# EAGLE design usbasp_mini (EAGLE 7.1.0)
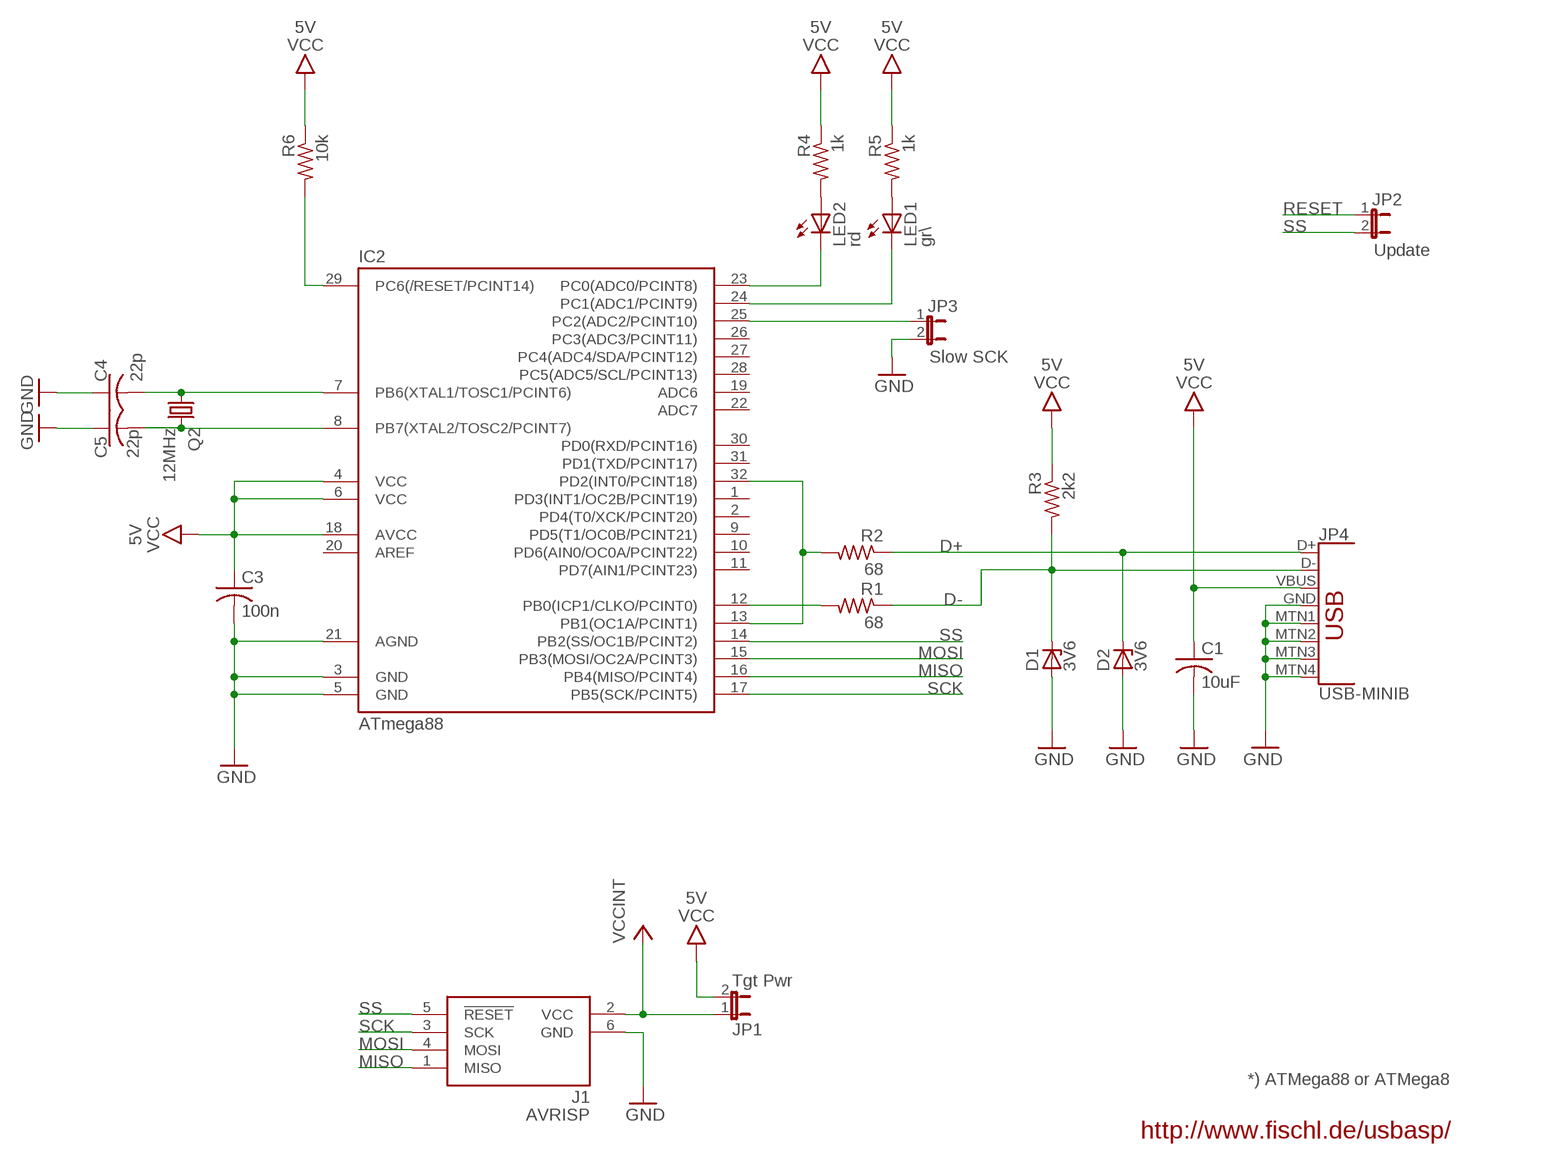
[diagram p0: schematic, sheet 1]

## Parts
C1  10uF  C-1206  [1206]
C3  100n  C-0603  [0603]
C4  22p  C-0603  [0603]
C5  22p  C-0603  [0603]
D1  3V6  ZENER-DIODESMB  [SMB]
D2  3V6  ZENER-DIODESMB  [SMB]
IC2  ATmega88  MEGA48/88/168-AU  [TQFP32-08]
J1  AVRISP  AVRISP6_COMPACT  [CON6P2R]
JP1  Tgt Pwr  JP1E  [JP1]
JP2  Update  JP1E  [JP1]
JP3  Slow SCK  JP1E  [JP1]
JP4  USB-MINIB  [USB-MINIB]
LED1  gr\  LEDCHIPLED_0603  [CHIPLED_0603]
LED2  rd  LEDCHIPLED_0603  [CHIPLED_0603]
Q2  12MHz  CRYSTALNDK5X3  [NDK_2PAD_5X3]
R1  68  R0603  [0603]
R2  68  R0603  [0603]
R3  2k2  R0603  [0603]
R4  1k  R0603  [0603]
R5  1k  R0603  [0603]
R6  10k  R0603  [0603]

## Nets
D+: D2.C JP4.D+ R2.1
D-: D1.C JP4.D- R1.1 R3.2
GND: C1.2(-) C3.2(-) C4.1(+) C5.1(+) D1.A D2.A IC2.3(GND) IC2.5(GND) IC2.21(AGND) J1.6(GND) JP3.2 JP4.GND JP4.MTN1(SHIELD1) JP4.MTN2(SHIELD2) JP4.MTN3(SHIELD3) JP4.MTN4(SHIELD4)
MISO: IC2.16(PB4(MISO/PCINT4)) J1.1(MISO)
MOSI: IC2.15(PB3(MOSI/OC2A/PCINT3)) J1.4(MOSI)
N$7: IC2.13(PB1(OC1A/PCINT1)) IC2.32(PD2(INT0/PCINT18)) R2.2
N$13: LED2.A R4.2
N$16: IC2.12(PB0(ICP1/CLKO/PCINT0)) R1.2
N$22: C4.2(-) IC2.7(PB6(XTAL1/TOSC1/PCINT6)) Q2.P$1
N$23: C5.2(-) IC2.8(PB7(XTAL2/TOSC2/PCINT7)) Q2.P$2
N$25: LED1.A R5.2
PC0: IC2.23(PC0(ADC0/PCINT8)) LED2.C
PC1: IC2.24(PC1(ADC1/PCINT9)) LED1.C
PC2: IC2.25(PC2(ADC2/PCINT10)) JP3.1
RESET: IC2.29(PC6(/RESET/PCINT14)) JP2.1 R6.2
SCK: IC2.17(PB5(SCK/PCINT5)) J1.3(SCK)
SS: IC2.14(PB2(SS/OC1B/PCINT2)) J1.5(!RESET) JP2.2
VCC: C1.1(+) C3.1(+) IC2.4(VCC) IC2.6(VCC) IC2.18(AVCC) JP1.2 JP4.VBUS R3.1 R4.1 R5.1 R6.1 ; supply symbol labelled 5V
VCCINT: J1.2(VCC) JP1.1
Unconnected: IC2.1(PD3(INT1/OC2B/PCINT19)) IC2.2(PD4(T0/XCK/PCINT20)) IC2.9(PD5(T1/OC0B/PCINT21)) IC2.10(PD6(AIN0/OC0A/PCINT22)) IC2.11(PD7(AIN1/PCINT23)) IC2.19(ADC6) IC2.20(AREF) IC2.22(ADC7) IC2.26(PC3(ADC3/PCINT11)) IC2.27(PC4(ADC4/SDA/PCINT12)) IC2.28(PC5(ADC5/SCL/PCINT13)) IC2.30(PD0(RXD/PCINT16)) IC2.31(PD1(TXD/PCINT17))

## Notes on the sheet
- *) ATMega88 or ATMega8
- http://www.fischl.de/usbasp/

## Library data of the parts
C1 C3-C5 = bt_rcl:C: Capacitor, non-polarized, American symbol
D1 D2 = diode:ZENER-DIODE: Z-Diode
IC2 = avr-7:MEGA48/88/168
J1 = bt_avr:AVRISP6: 6-pin dual-row connector for Atmel AVRISP programmer interface
JP1-JP3 = jumper:JP1E: JUMPER
JP4 = bt_electromech:USB: USB Connectors USB-MINI-B is fully proven USB-A-PCB is untested. USB-MICRO-B is untested.; PROD_ID: CONN-08193
LED1 LED2 = led:LED: LED OSRAM: - CHIPLED LG R971, LG N971, LY N971, LG Q971, LY Q971, LO R971, LY R971 LH N974, LH R974 LS Q976, LO Q976, LY Q976 LO Q996 - Hyper CHIPLED LW Q18S LB Q993, LB Q99A, LB R99A - SideLED LS A670, LO A670, LY A670, LG A670, LP A670 LB A673, LV A673, LT A673, LW A673 LH A674 LY A675 LS A676, LA A676, LO A676, LY A676, LW A676 LS A679, LY A679, LG A679 - Hyper Micro SIDELED® LS Y876, LA Y876, LO Y876, LY Y876 LT Y87S - SmartLED LW L88C, LW L88S LB L89C, LB L89S, LG L890 LS L89K, LO L89K, LY L89K LS L896, LA L896, LO L896, LY L896 - TOPLED LS T670, LO T670, LY T670, LG T670, LP T670 LSG T670, LSP T670, LSY T670, LOP T670, LYG T670 LG T671, LOG T671, LSG T671 LB T673, LV T673, LT T673, LW T673 LH T674 LS T676, LA T676, LO T676, LY T676, LB T676, LH T676, LSB T676, LW T676 LB T67C, LV T67C, LT T67C, LS T67K, LO T67K, LY T67K, LW E67C LS E67B, LA E67B, LO E67B, LY E67B, LB E67C, LV E67C, LT E67C LW T67C LS T679, LY T679, LG T679 LS T770, LO T770, LY T770, LG T770, LP T770 LB T773, LV T773, LT T773, LW T773 LH T774 LS E675, LA E675, LY E675, LS T675 LS T776, LA T776, LO T776, LY T776, LB T776 LHGB T686 LT T68C, LB T68C - Hyper Mini TOPLED® LB M676 - Mini TOPLED Santana® LG M470 LS M47K, LO M47K, LY M47K Source: http://www.osram.convergy.de/
Q2 = bt_crystal:CRYSTAL: CRYSTAL
R1-R6 = bt_rcl:R: Resistor, American symbol

## Board
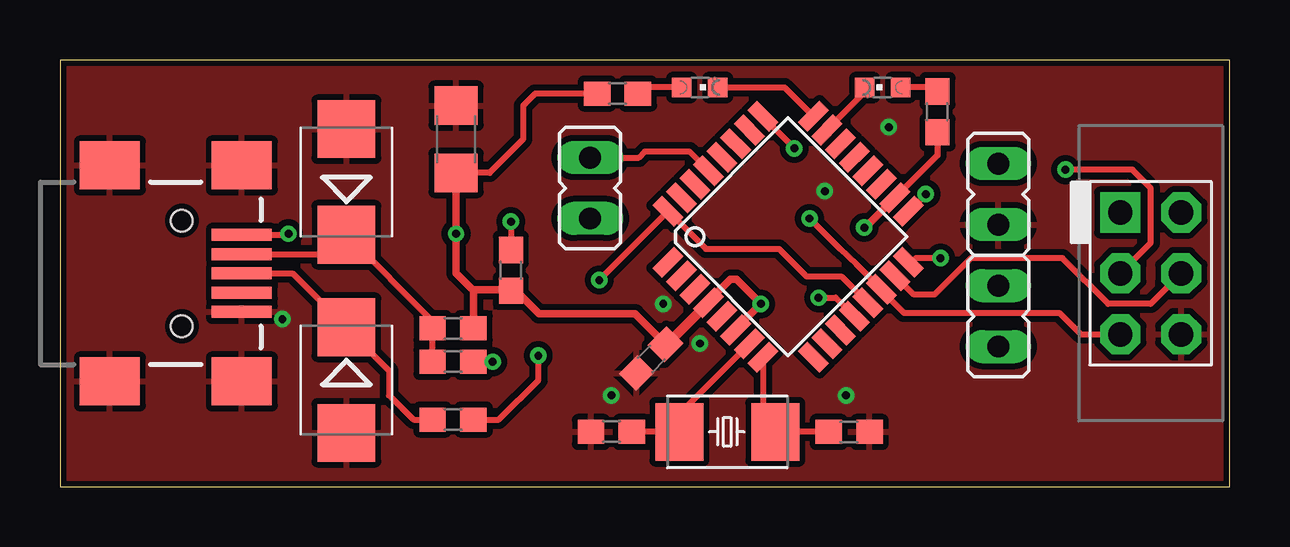
[diagram p1: board, top side]
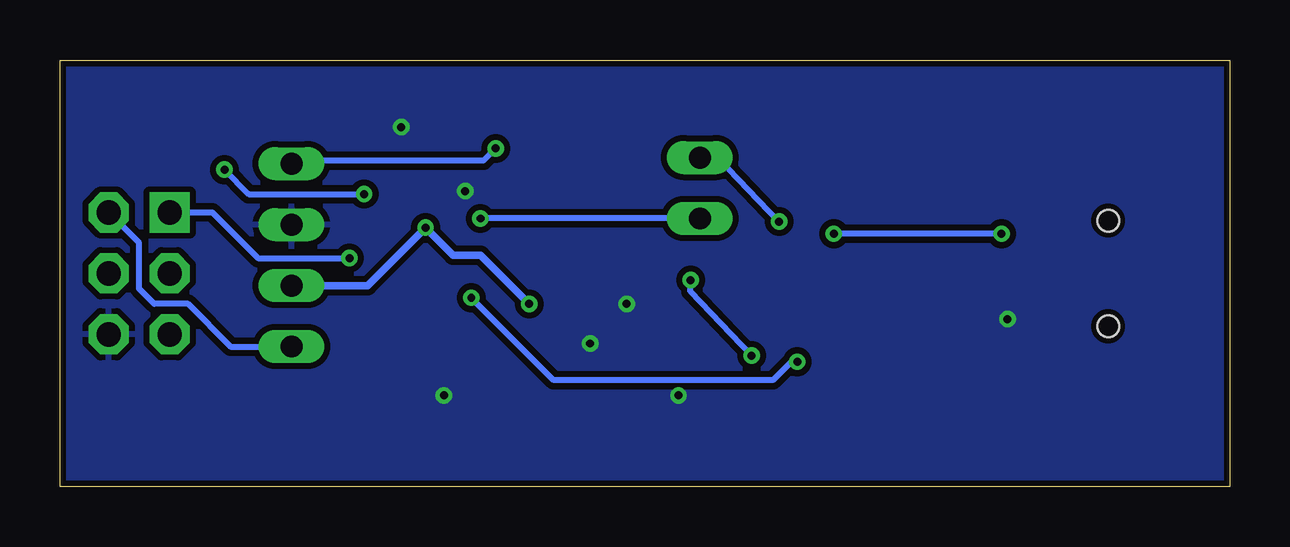
[diagram p2: board, bottom side, seen from below]

Size 48.77 x 17.78 mm. Coordinates in mm from the lower left corner, seen from the top.
Outline: 0,0 48.77,0 48.77,17.78 0,17.78 0,0
Copper layers (1*16): Top 0.0356mm / dielectric 1.5011mm / Bottom 0.0356mm
Design rules "LaenPCBOrder *": minimum track width 6mil, minimum drill 13mil, track to track 10mil, track to pad 8mil, pad to pad 8mil, via to via 10mil, smd to smd 8mil, copper to edge 10mil, drill to drill 10mil, minimum pad ring 7mil, minimum via ring 7mil, stop-mask expansion 3mil, vias tented up to drill 20mil, thermal gap 10mil

### Footprints (pad centres in the part's own frame; a part is rotated, then mirrored left to right if it is on the bottom)
1206 = smd 1.6 x 1.8: 1 -1.4,0; 2 1.4,0
0603 = smd 1.1 x 1: 1 -0.85,0; 2 0.85,0
SMB = smd 2.4 x 2.4: A 2.2,0; C -2.2,0
TQFP32-08 = smd 1.27 x 0.559: 1 -4.293,2.8; 2 -4.293,2; 3 -4.293,1.2; 4 -4.293,0.4; 5 -4.293,-0.4; 6 -4.293,-1.2; 7 -4.293,-2; 8 -4.293,-2.8; 17 4.293,-2.8; 18 4.293,-2; 19 4.293,-1.2; 20 4.293,-0.4; 21 4.293,0.4; 22 4.293,1.2; 23 4.293,2; 24 4.293,2.8 | smd 0.559 x 1.27: 9 -2.8,-4.293; 10 -2,-4.293; 11 -1.2,-4.293; 12 -0.4,-4.293; 13 0.4,-4.293; 14 1.2,-4.293; 15 2,-4.293; 16 2.8,-4.293; 25 2.8,4.293; 26 2,4.293; 27 1.2,4.293; 28 0.4,4.293; 29 -0.4,4.293; 30 -1.2,4.293; 31 -2,4.293; 32 -2.8,4.293
CON6P2R = drill 1.016 pad 1.676 square: 1 -2.54,-1.27 | drill 1.016 pad 1.676 octagon: 2 -2.54,1.27; 3 0,-1.27; 4 0,1.27; 5 2.54,-1.27; 6 2.54,1.27
JP1 = drill 0.914 long: 1 0,-1.27; 2 0,1.27
USB-MINIB = smd 2.5 x 0.5: D+ 2.5,0; D- 2.5,0.8; GND 2.5,-1.6; ID 2.5,-0.8; VBUS 2.5,1.6 | smd 2.5 x 2: MTN1 -3,4.5; MTN2 2.5,4.5; MTN3 -3,-4.5; MTN4 2.5,-4.5 | hole 0.9: 0,2.2; 0,-2.2
CHIPLED_0603 = smd 0.8 x 0.8: A 0,-0.75; C 0,0.75
NDK_2PAD_5X3 = smd 2 x 2.4: P$1 -2,0; P$2 2,0

### Placement (x,y rotation side)
C1  16.51,14.48 90 top
C3  24.64,5.33 225 top
C4  22.99,2.29 0 top
C5  32.89,2.29 180 top
D1  11.94,12.7 90 top
D2  11.94,4.45 270 top
IC2  30.35,10.41 45 top
J1  45.47,8.89 270 top
JP1  39.12,7.11 0 top
JP2  22.1,12.45 180 top
JP3  39.12,12.19 180 top
JP4  5.08,8.89 0 top
LED1  26.67,16.64 270 top
LED2  34.29,16.64 90 top
Q2  27.81,2.29 0 top
R1  16.38,5.21 0 top
R2  16.38,2.79 0 top
R3  16.38,6.6 180 top
R4  36.58,15.62 90 top
R5  23.24,16.38 0 top
R6  18.8,9.02 90 top

### Tracks (layer width: path | path; a pad name or v marks a point on that pad's centre or on a via)
D+
  Top 0.254: JP4.D+ 9.69,8.89 D2.C 11.94,6.6 13.72,4.83 13.72,3.81 14.73,2.79 R2.1
D-
  Top 0.254: JP4.D- 11.13,9.69 D1.C 15.58,6.86 R3.2 15.49,5.46 15.53,5.42 R1.1
GND  (via drill 0.33)
  other vias: 31.88,12.32 34.54,14.99 9.27,6.99 32.77,3.81 22.99,3.81 26.67,5.97 25.15,7.62
  pour Top: 0,17.78 48.77,17.78 48.77,0 0,0
  pour Bottom: 0,17.78 48.77,17.78 48.77,0 0,0
MISO  (via drill 0.33)
  Top 0.254: v36.7,9.53 35.69,9.53 35.46,9.27 IC2.16
  Bottom 0.254: J1.1 42.42,11.43 40.51,9.53 v36.7,9.53
MOSI
  Top 0.254: J1.4 45.47,7.62 43.69,7.62 41.78,9.53 37.97,9.53 36.45,8 35.59,8 IC2.15
N$7  (via drill 0.33)
  Top 0.254: IC2.13 32.57,8.76 31.11,8.76 29.97,9.91 26.92,9.91 25.36,11.47 IC2.32 v22.48,8.61 | R2.2 18.29,2.79 19.94,4.45 v19.94,5.46
  Bottom 0.254: v19.94,5.46 22.48,8.13 v22.48,8.61
N$13
  Top 0.254: R4.2 36.56,16.64 LED2.A
N$16  (via drill 0.33)
  Top 0.254: R1.2 v18.03,5.21 | v31.62,7.87 32.33,7.87 IC2.12
  Bottom 0.254: v18.03,5.21 18.29,5.21 19.05,4.45 28.19,4.45 v31.62,7.87
N$22
  Top 0.254: IC2.7 25.81,3.05 Q2.P$1 C4.2
N$23
  Top 0.254: IC2.8 29.3,2.8 Q2.P$2 C5.2
N$25
  Top 0.254: LED1.A 24.34,16.64 R5.2
PC0
  Top 0.254: LED2.C 33.75,16.64 IC2.23
PC1
  Top 0.254: LED1.C 30.2,16.64 IC2.24
PC2  (via drill 0.33)
  Top 0.254: IC2.25 29.3,15.41 v30.61,14.1
  Bottom 0.254: v30.61,14.1 31.11,13.59 38.99,13.59 JP3.1
RESET  (via drill 0.33)
  Top 0.254: JP2.1 24.13,13.72 24.38,13.97 26.23,13.97 IC2.29 | v18.8,11.05 R6.2
  Bottom 0.254: JP2.1 21.34,13.72 v18.8,11.05
SCK  (via drill 0.33)
  Top 0.254: J1.3 45.47,10.16 45.47,12.45 44.7,13.21 v41.91,13.21 | v36.09,12.19 IC2.17
  Bottom 0.254: v41.91,13.21 40.89,12.19 v36.09,12.19
SS  (via drill 0.33)
  Top 0.254: v31.24,11.18 32.51,9.91 33.19,9.27 IC2.14 34.24,8.18 35.18,7.24 41.66,7.24 42.55,6.35 J1.5
  Bottom 0.254: JP2.2 v31.24,11.18
VCC  (via drill 0.33)
  Top 0.254: R5.1 19.81,16.38 19.3,15.88 19.3,14.48 17.91,13.08 C1.1 | R4.1 36.58,13.81 IC2.18 | JP4.VBUS 9.22,10.49 v9.53,10.54
  Top 0.305: IC2.4 27.09,7.66 27.09,7.79 27.94,8.64 28.19,8.64 v29.21,7.62 28.17,6.58 IC2.6 | v33.53,10.79 33.56,10.79 IC2.18 | R3.1 17.23,8.13 | 17.23,8.13 17.23,8.17 16.51,8.89 v16.51,10.54 C1.1 | R6.1 18.8,8.22 | 18.8,8.22 19.05,8.13 19.98,7.2 23.97,7.2 C3.1 | 18.8,8.22 17.32,8.22 17.23,8.13
  Top 0.406: C3.1 25.25,5.88 IC2.4
  Bottom 0.254: v9.53,10.54 v16.51,10.54
  Bottom 0.305: v29.21,7.62 31.24,9.65 32.38,9.65 v33.53,10.79 35.94,8.38 JP1.2
VCCINT
  Bottom 0.254: J1.2 45.47,10.16 45.47,8.26 44.83,7.62 43.43,7.62 41.66,5.84 JP1.1